# EAGLE design atmega328p (EAGLE 8.1.0)
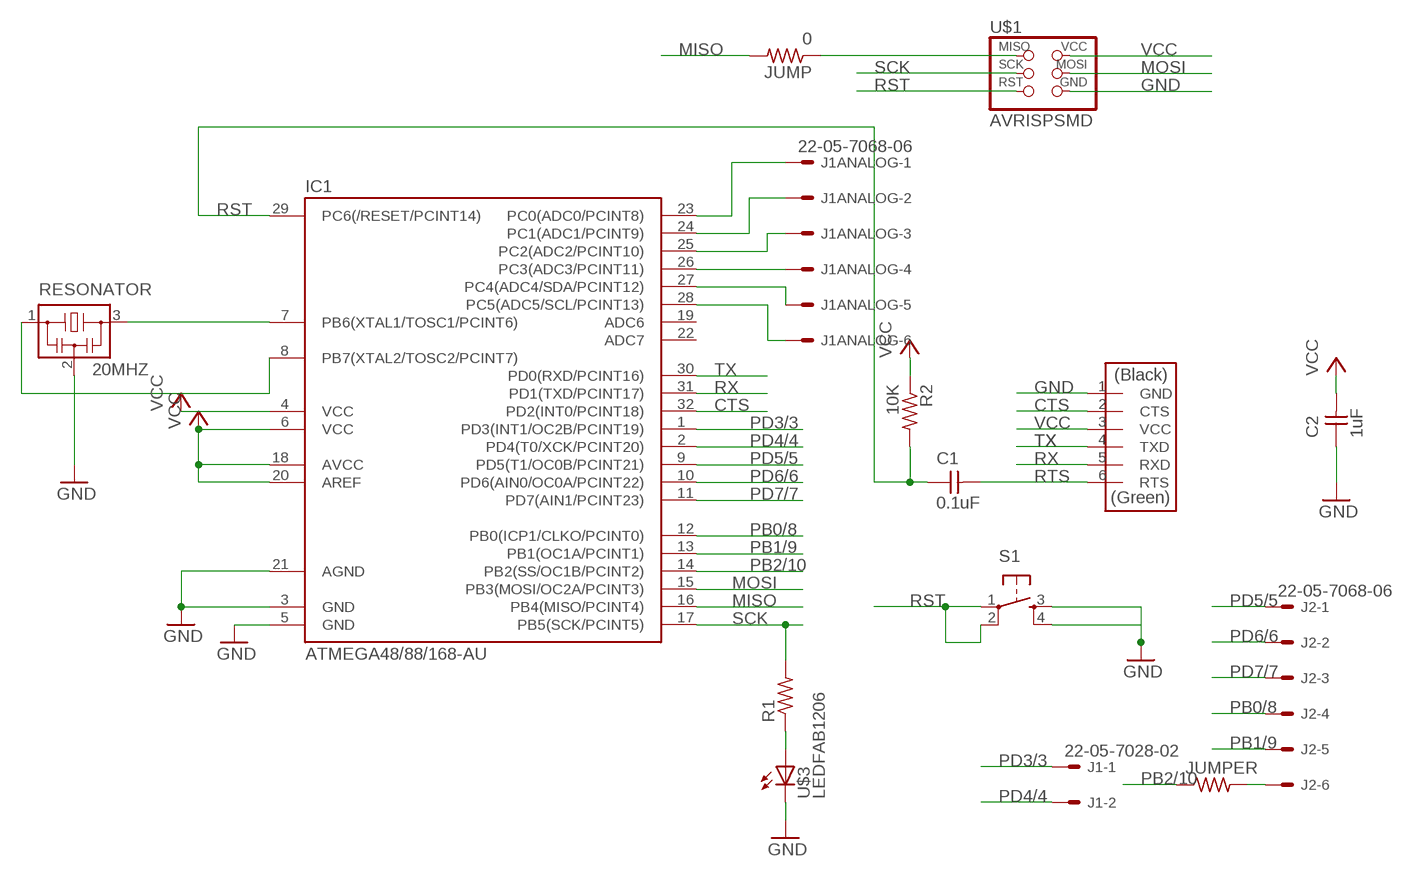
[diagram p0: schematic, sheet 1]

## Parts
C1  0.1uF  CAP-UNPOLARIZEDFAB  [C1206FAB]
C2  1uF  CAP-UNPOLARIZEDFAB  [C1206FAB]
IC1  ATMEGA48/88/168-AU  [TQFP32-08]
J1  22-05-7028-02  [7395-02]
J1ANALOG  22-05-7068-06  [7395-06]
J2  22-05-7068-06  [7395-06]
JUMP  0  RES-US1206FAB  [R1206FAB]
JUMPER  RES-US1206FAB  [R1206FAB]
R1  RES-US1206FAB  [R1206FAB]
R2  10K  RES-US1206FAB  [R1206FAB]
RESONATOR  20MHZ  RESONATOR  [EFOBM]
S1  6MM_SWITCH6MM_SWITCH  [6MM_SWITCH]
U$1  AVRISPSMD  [2X03SMD]
U$2  FTDI-SMD-HEADER  [1X06SMD]
U$3  LEDFAB1206  [LED1206FAB]

## Nets
CTS: IC1.32(PD2(INT0/PCINT18)) U$2.2(CTS)
GND: C2.1 IC1.3(GND) IC1.5(GND) IC1.21(AGND) RESONATOR.2 S1.3(S) S1.4(S1) U$1.6(GND) U$2.1(GND) U$3.2(C)
MISO: IC1.16(PB4(MISO/PCINT4)) JUMP.2
MOSI: IC1.15(PB3(MOSI/OC2A/PCINT3)) U$1.4(MOSI)
N$1: IC1.7(PB6(XTAL1/TOSC1/PCINT6)) RESONATOR.3
N$2: IC1.8(PB7(XTAL2/TOSC2/PCINT7)) RESONATOR.1
N$3: JUMP.1 U$1.1(MISO)
N$4: J2.6 JUMPER.2
N$9: IC1.23(PC0(ADC0/PCINT8)) J1ANALOG.1
N$10: R1.1 U$3.1(A)
N$11: IC1.24(PC1(ADC1/PCINT9)) J1ANALOG.2
N$12: IC1.25(PC2(ADC2/PCINT10)) J1ANALOG.3
N$13: IC1.26(PC3(ADC3/PCINT11)) J1ANALOG.4
N$14: IC1.27(PC4(ADC4/SDA/PCINT12)) J1ANALOG.5
N$15: IC1.28(PC5(ADC5/SCL/PCINT13)) J1ANALOG.6
PB0/8: IC1.12(PB0(ICP1/CLKO/PCINT0)) J2.4
PB1/9: IC1.13(PB1(OC1A/PCINT1)) J2.5
PB2/10: IC1.14(PB2(SS/OC1B/PCINT2)) JUMPER.1
PD3/3: IC1.1(PD3(INT1/OC2B/PCINT19)) J1.1
PD4/4: IC1.2(PD4(T0/XCK/PCINT20)) J1.2
PD5/5: IC1.9(PD5(T1/OC0B/PCINT21)) J2.1
PD6/6: IC1.10(PD6(AIN0/OC0A/PCINT22)) J2.2
PD7/7: IC1.11(PD7(AIN1/PCINT23)) J2.3
RST: C1.1 IC1.29(PC6(/RESET/PCINT14)) R2.2 S1.1(P) S1.2(P1) U$1.5(RST)
RTS: C1.2 U$2.6(RTS)
RX: IC1.31(PD1(TXD/PCINT17)) U$2.5(RXD)
SCK: IC1.17(PB5(SCK/PCINT5)) R1.2 U$1.3(SCK)
TX: IC1.30(PD0(RXD/PCINT16)) U$2.4(TXD)
VCC: C2.2 IC1.4(VCC) IC1.6(VCC) IC1.18(AVCC) IC1.20(AREF) R2.1 U$1.2(VCC) U$2.3(VCC)
Unconnected: IC1.19(ADC6) IC1.22(ADC7)

## Library data of the parts
C1 C2 = fab:CAP-UNPOLARIZED
IC1 = atmega8:ATMEGA48/88/168
J1 = con-molex:22-?-02: CONNECTOR wire to board 2.54 mm (.1 inch) pitch header; OC_FARNELL: 9731601; OC_NEWARK: unknown
J1ANALOG J2 = con-molex:22-?-06: CONNECTOR wire to board 2.54 mm (.1 inch) pitch header; OC_FARNELL: unknown; OC_NEWARK: unknown
JUMP JUMPER R1 R2 = fab:RES-US: Resistor (US Symbol) Variants with postfix FAB are widened to allow the routing of internal traces
RESONATOR = fab:RESONATOR
S1 = fab:6MM_SWITCH: OMRON SWITCH
U$1 = fab:AVRISP
U$2 = fab:FTDI-SMD-HEADER
U$3 = fab:LED: LED

## Board
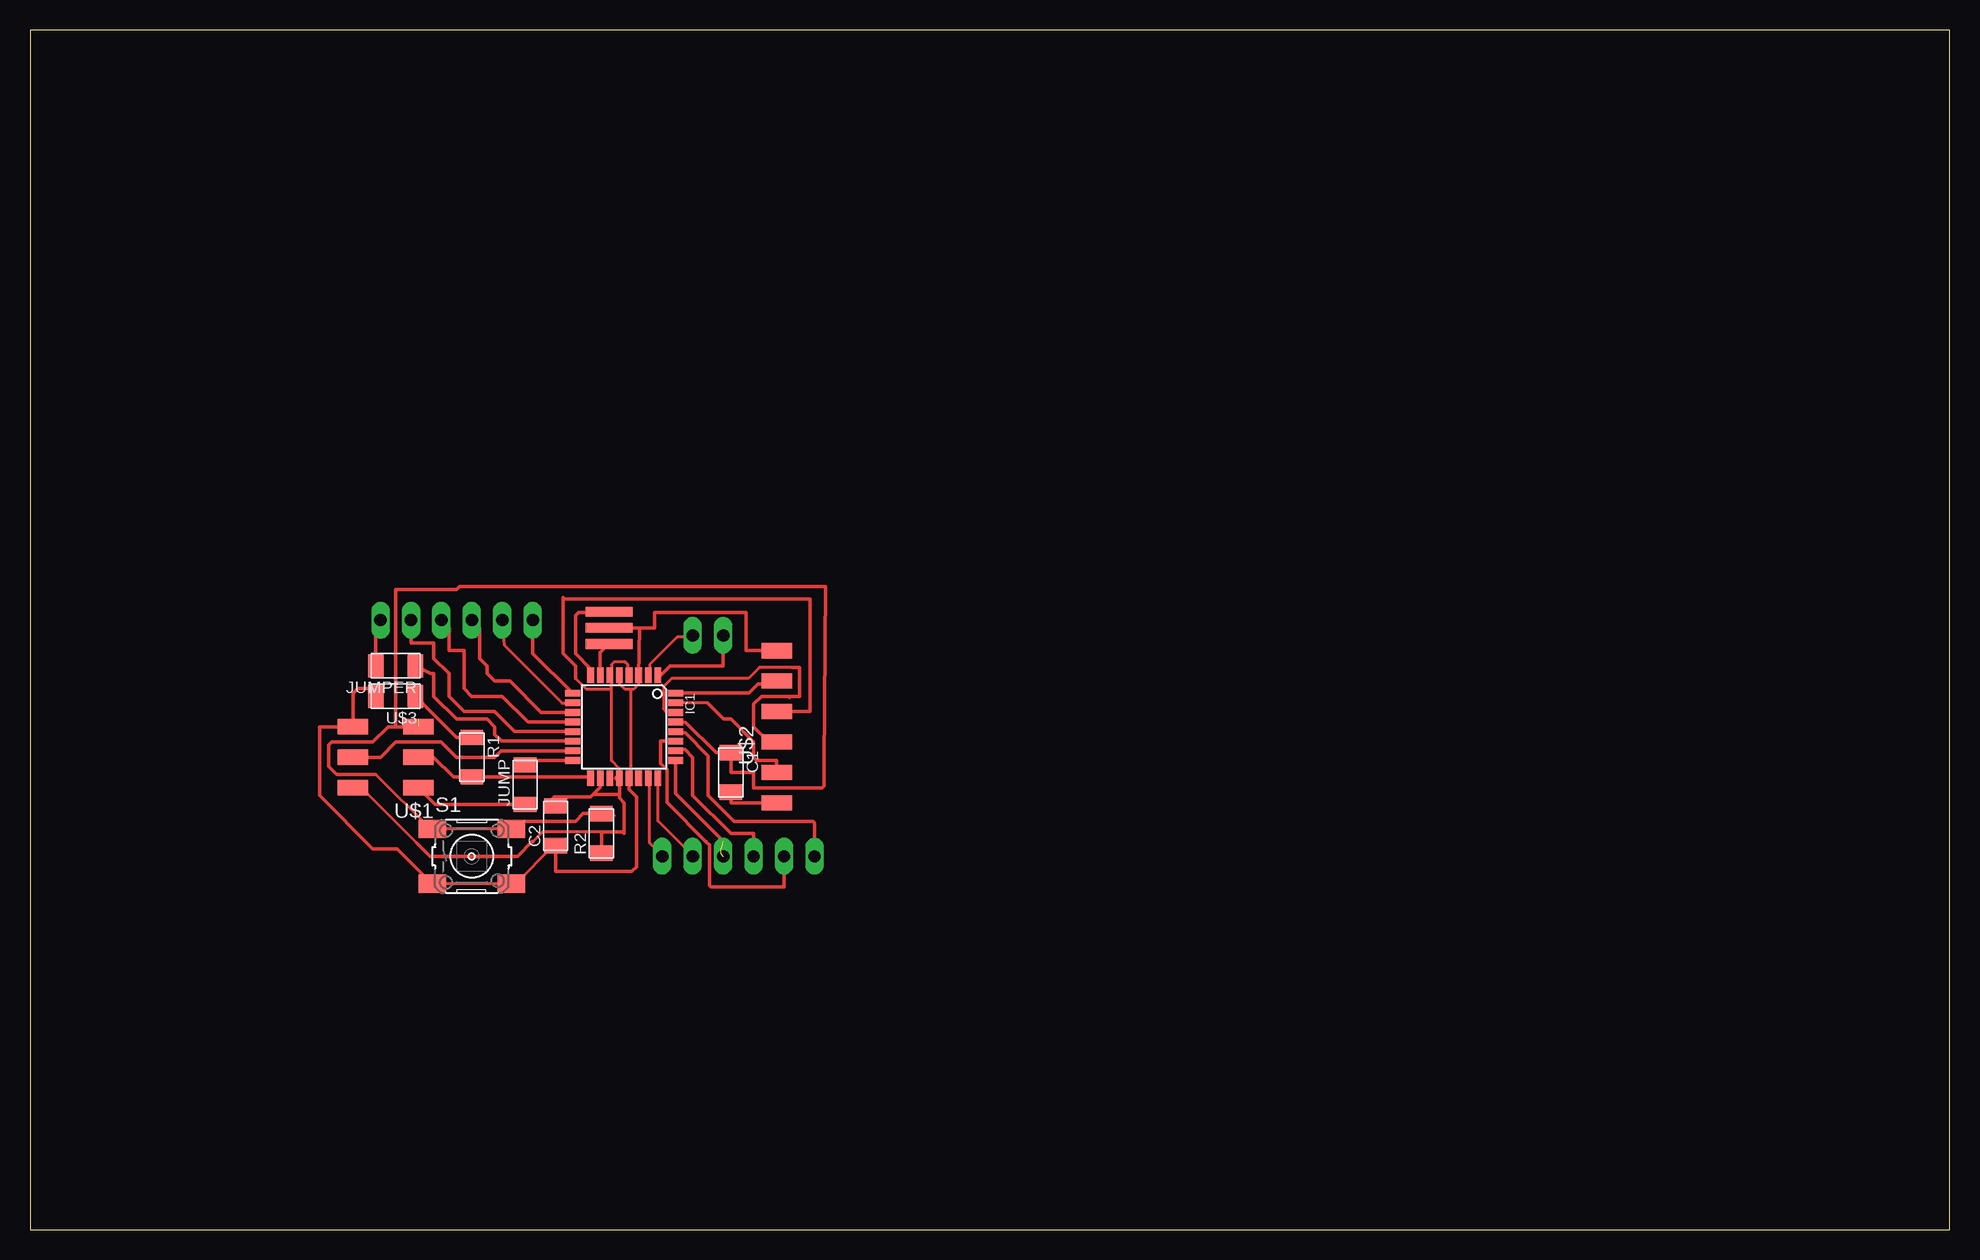
[diagram p1: board, top side]
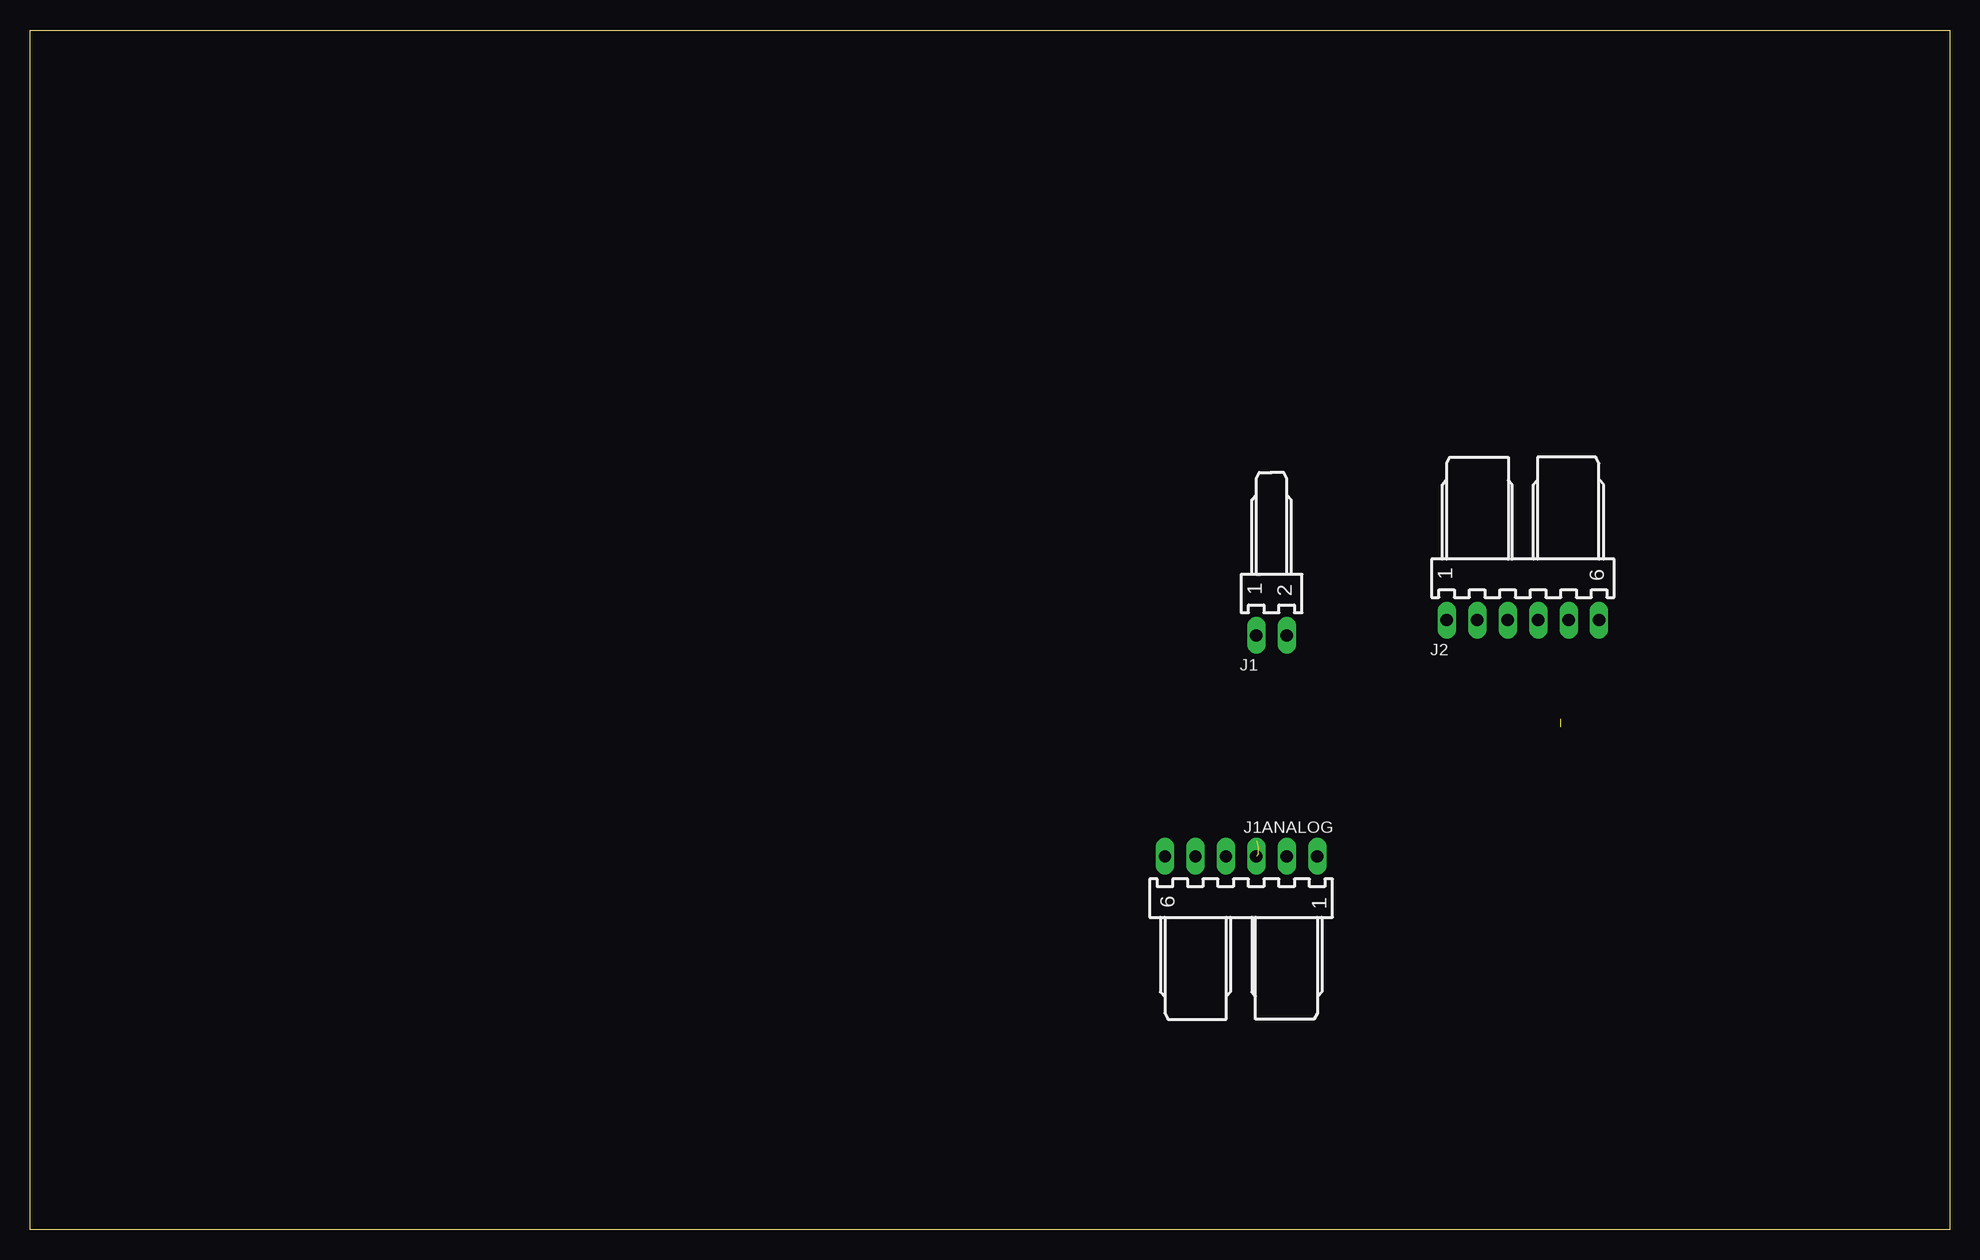
[diagram p2: board, bottom side, seen from below]

Size 160 x 100 mm. Coordinates in mm from the lower left corner, seen from the top.
Outline: 0,0 160,0 160,100 0,100 0,0
Copper layers (1*16): Top 0.035mm / dielectric 1.5mm / Bottom 0.035mm
Design rules "default": minimum track width 10mil, minimum drill 24mil, track to track 8mil, track to pad 8mil, pad to pad 8mil, via to via 8mil, smd to smd 8mil, copper to edge 40mil, drill to drill 8mil, minimum pad ring 10mil, minimum via ring 8mil, stop-mask expansion 4mil, vias tented up to drill 0mil, thermal gap 10mil

### Footprints (pad centres in the part's own frame; a part is rotated, then mirrored left to right if it is on the bottom)
C1206FAB = smd 1.27 x 1.905: 1 -1.651,0; 2 1.651,0
TQFP32-08 = smd 1.27 x 0.559: 1 -4.293,2.8; 2 -4.293,2; 3 -4.293,1.2; 4 -4.293,0.4; 5 -4.293,-0.4; 6 -4.293,-1.2; 7 -4.293,-2; 8 -4.293,-2.8; 17 4.293,-2.8; 18 4.293,-2; 19 4.293,-1.2; 20 4.293,-0.4; 21 4.293,0.4; 22 4.293,1.2; 23 4.293,2; 24 4.293,2.8 | smd 0.559 x 1.27: 9 -2.8,-4.293; 10 -2,-4.293; 11 -1.2,-4.293; 12 -0.4,-4.293; 13 0.4,-4.293; 14 1.2,-4.293; 15 2,-4.293; 16 2.8,-4.293; 25 2.8,4.293; 26 2,4.293; 27 1.2,4.293; 28 0.4,4.293; 29 -0.4,4.293; 30 -1.2,4.293; 31 -2,4.293; 32 -2.8,4.293
7395-02 = drill 1.016 long: 1 1.27,0; 2 -1.27,0
7395-06 = drill 1.016 long: 1 6.35,0; 2 3.81,0; 3 1.27,0; 4 -1.27,0; 5 -3.81,0; 6 -6.35,0
R1206FAB = smd 1.27 x 1.905: 1 -1.651,0; 2 1.651,0
EFOBM = smd 0.8 x 3.9: 1 -1.35,0; 2 0,0; 3 1.35,0
6MM_SWITCH = smd 2.286 x 1.524: 1 -3.302,2.286; 2 3.302,2.286; 3 -3.302,-2.286; 4 3.302,-2.286
2X03SMD = smd 2.54 x 1.27: 1 -2.54,2.54; 2 2.92,2.54; 3 -2.54,0; 4 2.92,0; 5 -2.54,-2.54; 6 2.92,-2.54
1X06SMD = smd 2.54 x 1.27: 1 0,6.35; 2 0,3.81; 3 0,1.27; 4 0,-1.27; 5 0,-3.81; 6 0,-6.35
LED1206FAB = smd 1.27 x 1.905: 1 -1.651,0; 2 1.651,0

### Placement (x,y rotation side)
C1  58.42,38.1 270 top
C2  43.81,33.66 90 top
IC1  49.53,41.91 270 top
J1  56.52,49.53 180 bottom
J1ANALOG  59.05,31.11 0 bottom
J2  35.56,50.8 180 bottom
JUMP  41.27,37.08 90 top
JUMPER  30.48,46.99 180 top
R1  36.83,39.37 270 top
R2  47.62,33.02 90 top
RESONATOR  48.26,50.16 270 top
S1  36.83,31.11 0 top
U$1  29.84,39.37 180 top
U$2  62.23,41.91 0 top
U$3  30.48,44.45 180 top

### Tracks (layer width: path | path; a pad name or v marks a point on that pad's centre or on a via)
CTS
  Top 0.254: 53.95,44.81 IC1.32 | U$2.2 62.18,45.72
  Top 0.305: IC1.32 59.95,44.71 60.71,45.47 61.98,45.47 U$2.2
  Top 0.406: IC1.32
GND
  Top 0.254: C2.1 43.66,32 40.46,28.8 S1.4 40.01,28.8 33.83,28.8 S1.3 | 50.06,45.03 50.29,45.03 50.75,45.49 50.75,46.18 IC1.3 50.75,46.41 | 50.06,45.03 49.61,45.03 49.15,45.49 49.15,46.18 IC1.5 | 50.06,45.03 50.06,37.72 IC1.21 50.06,37.49 | 61.27,48.46 62.18,48.46 U$2.1 | 26.29,41.83 26.75,41.83 U$1.6
  Top 0.305: 49.93,37.19 IC1.21 49.93,36.68 50.55,36.07 50.55,30.23 50.16,29.84 43.81,29.84 C2.1 | U$1.6 24.13,41.91 24.13,36.2 28.57,31.75 30.61,31.75 S1.3 | U$2.1 59.69,48.26 59.69,51.44 52.07,51.44 52.07,50.16 50.8,50.16 | 50.8,50.16 RESONATOR.2 | IC1.3 50.8,50.16 | U$1.6 26.93,42.8 | U$1.6 26.93,44.7 27.3,45.09 28.19,45.09 U$3.2
  Top 0.406: S1.3 33.66,28.83 | S1.4 40.64,28.83 | 50.8,46.2 IC1.3
MISO
  Top 0.305: IC1.16 41.28,39.11 JUMP.2
MOSI
  Top 0.254: 27.66,39.55 26.98,39.55 U$1.4 | 45.03,40.01 IC1.15
  Top 0.305: IC1.15 39.27,39.91 38.73,39.37 35.56,39.37 34.29,40.64 30.48,40.64 29.21,39.37 U$1.4
N$1
  Top 0.305: 47.55,46.41 47.53,46.39 IC1.7 47.53,48.09 RESONATOR.3
N$2
  Top 0.305: IC1.8 46.73,46.74 45.47,48.01 45.47,51.18 45.72,51.44 48.18,51.44 RESONATOR.1
N$3
  Top 0.305: JUMP.1 33.78,35.43 U$1.1
N$4
  Top 0.305: JUMPER.2 28.83,50.42 J2.6
N$9
  Top 0.254: IC1.23 51.66,37.49 51.66,32.23 52.58,31.32 J1ANALOG.1
N$10
  Top 0.305: R1.1 35.56,41.02 U$3.1
N$11
  Top 0.254: IC1.24 52.35,37.49 52.35,34.06 55.09,31.32 J1ANALOG.2
N$12  (3 unrouted)
  Top 0.254: 53.95,39.09 IC1.25
  Top 0.305: IC1.25 53.82,36.35 57.78,32.38
N$13
  Top 0.254: IC1.26 53.95,39.78
  Top 0.305: J1ANALOG.4 60.33,33.02 58.42,33.02 55.24,36.2 55.24,39.37 54.61,40.01 53.92,40.01 IC1.26
N$14
  Top 0.305: IC1.27 52.58,40.71 52.58,38.86 53.09,38.35 53.09,35.61 56.41,32.28 | J1ANALOG.5 62.87,28.57 56.77,28.57 56.64,28.7 56.64,32.06 56.41,32.28 | 56.41,32.28 56.36,32.34
N$15
  Top 0.254: 54.63,41.38 53.95,41.38 IC1.28 | 65.38,31.32 J1ANALOG.6
  Top 0.305: 54.63,41.38 56.52,39.5 56.52,36.2 58.67,34.04 65.28,34.04 65.41,33.91 J1ANALOG.6
PB0/8
  Top 0.305: IC1.12 41.51,42.31 39.37,44.45 36.83,44.45 36.2,45.09 36.2,48.26 34.92,48.26 34.92,50.16 J2.4
PB1/9
  Top 0.305: IC1.13 41.27,41.51 | 41.27,41.51 41.04,41.51 | J2.5 31.75,48.9 33.66,48.9 33.66,47.62 34.92,46.35 34.92,44.45 36.2,43.18 38.73,43.18 40.41,41.51 41.27,41.51
PB2/10
  Top 0.305: IC1.14 39.3,40.71 38.73,41.27 38.73,41.91 38.1,42.55 35.56,42.55 33.66,44.45 33.66,46.35 33.4,46.35 JUMPER.1
PD3/3
  Top 0.254: 52.35,46.41 IC1.1
  Top 0.305: IC1.1 52.55,46.2 53.34,46.99 57.78,46.99 J1.1
PD4/4
  Top 0.254: IC1.2 51.66,46.41 51.66,47.09 53.95,49.38 55.09,49.38 J1.2
PD5/5
  Top 0.254: IC1.9 45.03,44.81
  Top 0.305: J2.1 41.91,48.04 IC1.9
PD6/6
  Top 0.254: IC1.10 45.03,43.89 44.35,43.89 39.55,48.69 J2.2
PD7/7
  Top 0.254: 45.03,43.2 IC1.11
  Top 0.305: IC1.11 42.62,43.11 40.01,45.72 38.73,45.72 38.1,46.35 38.1,46.99 37.47,47.62 37.47,50.16 J2.3
RST  (1 unrouted)
  Top 0.254: 54.63,42.29 53.95,42.29 IC1.29 | 48.69,34.52 R2.2 | 40.23,33.6 S1.2 40.01,33.38 33.6,33.38 S1.1 33.38,33.38 28.8,37.95 | 32.23,41.83 U$1.5 32.46,42.06 | 66.19,38.41 66.19,38.73
  Top 0.305: 54.63,42.29 57.17,39.75 C1.1 58.42,38.1 60.33,38.1 60.33,36.83 66.04,36.83 66.19,36.98 66.19,38.73 66.29,53.59 35.81,53.59 35.56,53.34 30.48,53.34 30.48,41.91 | R2.2 46.1,34.67 45.47,34.04 40.77,34.04 S1.2 | 30.48,41.91 U$1.5 | 30.48,41.91 29.84,41.91 28.57,40.64 25.15,40.64 24.89,40.39 24.89,38.61 25.55,37.95 28.8,37.95
RTS
  Top 0.254: 61.95,35.2 62.18,35.43 U$2.6
  Top 0.305: C1.2 58.42,35.56 U$2.6
RX
  Top 0.254: 56.46,43.89 53.95,43.89 IC1.31 | 62.18,38.18 U$2.5
  Top 0.305: U$2.5 62.23,39.12 60.58,39.12 60.33,39.37 60.33,40.64 58.42,42.55 57.81,42.55 56.46,43.89
  Top 0.406: 53.82,43.81 IC1.31
SCK
  Top 0.254: IC1.17 46.63,37.72 | U$1.3 32.46,39.32
  Top 0.305: U$1.3 33.66,39.37 35.31,37.72 R1.2 46.63,37.72 IC1.17
TX
  Top 0.254: 63.55,46.86 63.5,46.86 60.81,46.86 59.89,45.95 53.49,45.95 52.81,45.26 52.81,43.43 53.03,43.2 53.72,43.2 IC1.30
  Top 0.305: 63.5,46.86 64.14,46.86 64.14,44.45 63.32,44.45 | 63.32,44.45 63.32,44.35 | U$2.4 61.59,40.64 60.33,41.91 60.33,43.81 60.96,44.45 63.32,44.45
  Top 0.406: 53.82,43.18 IC1.30
VCC
  Top 0.254: IC1.4 49.84,46.41 49.84,47.09 49.61,47.32 48.69,47.32 48.46,47.09 48.46,46.41 IC1.6 48.46,46.18 48.46,45.03 | 49.15,37.03 49.15,37.49 IC1.20 49.15,37.72 49.15,38.41 48.46,39.09 48.46,45.03 | C2.2 43.89,35.43 | 32.23,32.23 27.66,36.8 26.98,36.8 U$1.2 | 41.83,32.23 41.95,32.35 42.75,33.15 47.62,33.15 48.23,33.15 | 62.87,43.2 62.41,43.2 U$2.3 | 45.49,45.95 46.41,45.03 48.46,45.03
  Top 0.305: 49.13,36.2 IC1.20 | 49.13,36.2 49.13,35.96 49.53,35.56 49.53,33.02 49.4,33.15 47.62,33.15 R2.1 | IC1.18 47.53,36.86 46.93,36.26 | 46.93,36.26 46.74,36.07 43.69,36.07 43.18,35.56 43.56,35.56 C2.2 | 46.93,36.26 49.07,36.26 49.13,36.2 | 41.95,32.35 41.87,32.35 40.64,31.11 33.35,31.11 32.23,32.23 | U$2.3 65.02,43.18 65.02,52.58 44.45,52.58 44.45,52.7 44.45,48.01 45.47,46.99 45.49,45.95
  Top 0.406: 49.02,37.62 IC1.20 48.9,37.62